# EAGLE design uctester (EAGLE 9.6.2)
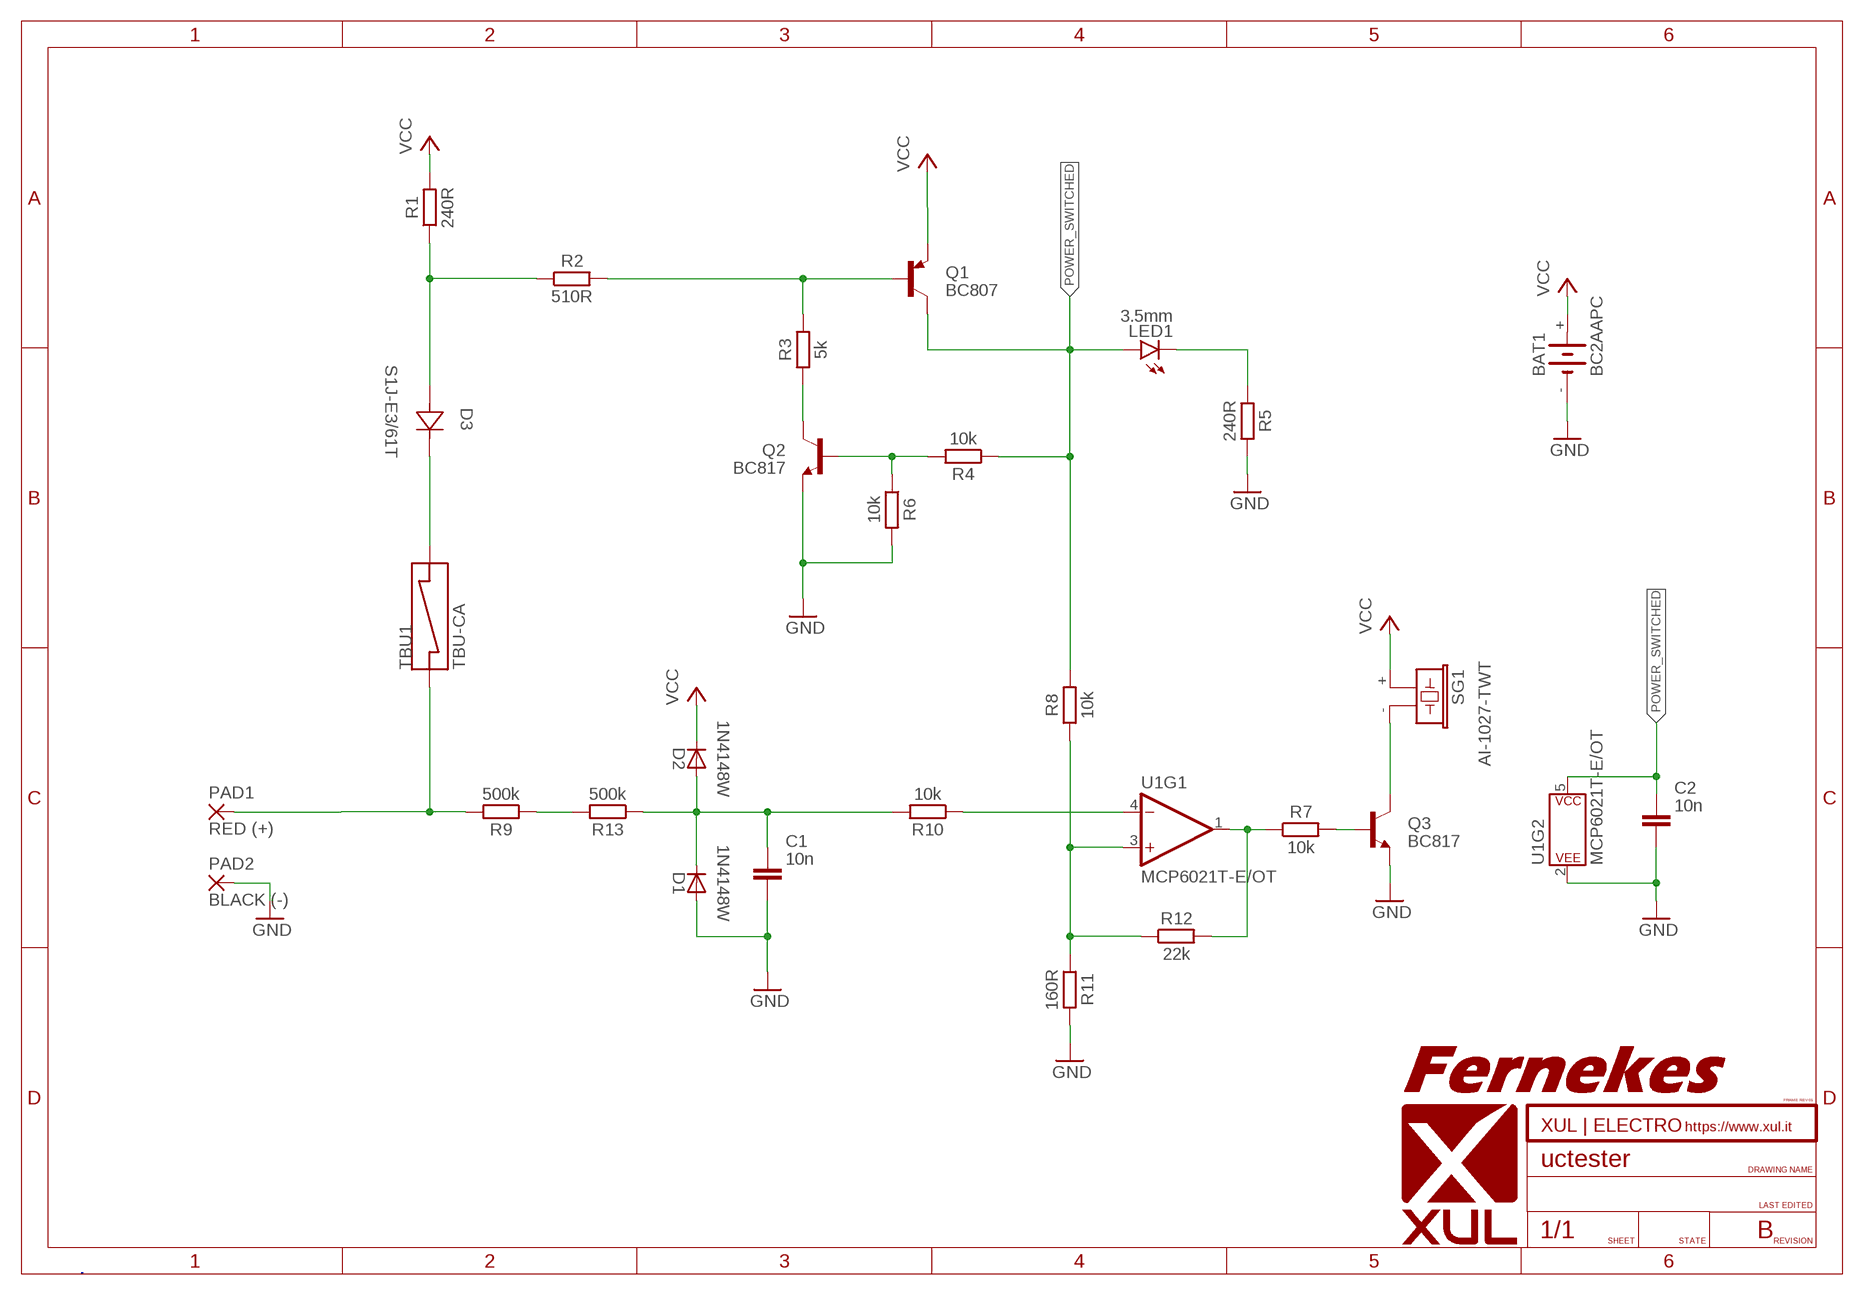
[diagram p0: schematic, sheet 1]
FRAME1 (FRAME-XUL-A4L-LOC): REV: B

## Parts
BAT1  BC2AAPC  [BC2AAPC]
C1  10n  C_CHIP-1206(3216-METRIC)  [CAPC3216X135]
C2  10n  C_CHIP-1206(3216-METRIC)  [CAPC3216X135]
D1  1N4148W  DIODESOD-123  [SOD-123]
D2  1N4148W  DIODESOD-123  [SOD-123]
D3  S1J-E3/61T  [DIODE_DO214AC]
LED1  3.5mm  LED5MM  [LED5MM]
PAD1  RED (+)  WIREPADSMD2,54-5,08  [SMD2,54-5,08]
PAD2  BLACK (-)  WIREPADSMD2,54-5,08  [SMD2,54-5,08]
Q1  BC807  BC807-40SMD  [SOT23-BEC]
Q2  BC817  BC817-40LT1SMD  [SOT23-BEC]
Q3  BC817  BC817-40LT1SMD  [SOT23-BEC]
R1  240R  R_CHIP-1206(3216-METRIC)  [RESC3216X70]
R2  510R  R_CHIP-1206(3216-METRIC)  [RESC3216X70]
R3  5k  R_CHIP-1206(3216-METRIC)  [RESC3216X70]
R4  10k  R_CHIP-1206(3216-METRIC)  [RESC3216X70]
R5  240R  R_CHIP-1206(3216-METRIC)  [RESC3216X70]
R6  10k  R_CHIP-1206(3216-METRIC)  [RESC3216X70]
R7  10k  R_CHIP-1206(3216-METRIC)  [RESC3216X70]
R8  10k  R_CHIP-1206(3216-METRIC)  [RESC3216X70]
R9  500k  R_CHIP-1206(3216-METRIC)  [RESC3216X70]
R10  10k  R_CHIP-1206(3216-METRIC)  [RESC3216X70]
R11  160R  R_CHIP-1206(3216-METRIC)  [RESC3216X70]
R12  22k  R_CHIP-1206(3216-METRIC)  [RESC3216X70]
R13  500k  R_CHIP-1206(3216-METRIC)  [RESC3216X70]
SG1  AI-1027-TWT  [AI-1027-TWT]
TBU1  TBU-CA  [RESDFN650X400X90-2N]
U1  MCP6021T-E/OT  [SOT95P280X145-5N]

## Nets
GND: BAT1.- C1.2 C2.2 D1.A PAD2.1(P) Q2.E Q3.E R5.2 R6.2 R11.2 U1.2(P$V-)
N$1: Q2.C R3.1
N$2: Q2.B R4.2 R6.1
N$3: R9.1 R13.2
N$4: R10.1 U1.4(-IN)
N$5: R8.1 R11.1 R12.1 U1.3(+IN)
N$6: R7.1 R12.2 U1.1(OUT)
N$7: Q3.B R7.2
N$8: Q3.C SG1.-
N$9: Q1.B R2.2 R3.2
N$11: C1.1 D1.C D2.A R10.2 R13.1
N$12: D3.2(A) R1.1 R2.1
N$13: PAD1.1(P) R9.2 TBU1.1
N$14: LED1.K(C) R5.1
N$15: D3.1(C) TBU1.3
POWER_SWITCHED: C2.1 LED1.A Q1.C R4.1 R8.2 U1.5(P$V+)
VCC: BAT1.+ D2.C Q1.E R1.2 SG1.+

## Notes on the sheet
- C:/Users/xi/Downloads/fernekes.bmp

## Library data of the parts
BAT1 = xul:BC2AAPC: BC2APPC 2x AA (series) battery holder, TH mount
C1 C2 = Capacitor:C: Capacitor - Generic; CATEGORY: Capacitor
D1 D2 = adafruit:DIODE: Diode SMADIODE - SMA Surface Mount Package 20V 1A Schottky Diode Digikey: 641-1014-6-ND DO-1N4148 - Through Hole Small Current Diode SOD-123 20V 1 A (.5mV Vf) Schottky Diode - Digikey: MBRX120TPMSCT-ND SOD-323 10V 570mA (.38mV Vf, 3ns) Schottky Diode - Digikey: ZLLS410CT-ND SOD-523 30V 30mA Schottky Diode (RB751S-40TE61) - Digikey: RB751S-40TE61CT-ND SOT23-R/W - SOT23 Package (R = Solder Paste/Reflow Ovens, W = Hand-Soldering) BAT54Film 40V 300mA - Digikey: 497-7162-1-ND
D3 = xul:S1J-E3/61T; BUILT_BY: EMA_UL_Team; MANUFACTURER_PART_NUMBER: S1J-E3/61T; VENDOR: Vishay
LED1 = led:LED: LED OSRAM: - CHIPLED LG R971, LG N971, LY N971, LG Q971, LY Q971, LO R971, LY R971 LH N974, LH R974 LS Q976, LO Q976, LY Q976 LO Q996 - Hyper CHIPLED LW Q18S LB Q993, LB Q99A, LB R99A - SideLED LS A670, LO A670, LY A670, LG A670, LP A670 LB A673, LV A673, LT A673, LW A673 LH A674 LY A675 LS A676, LA A676, LO A676, LY A676, LW A676 LS A679, LY A679, LG A679 - Hyper Micro SIDELED® LS Y876, LA Y876, LO Y876, LY Y876 LT Y87S - SmartLED LW L88C, LW L88S LB L89C, LB L89S, LG L890 LS L89K, LO L89K, LY L89K LS L896, LA L896, LO L896, LY L896 - TOPLED LS T670, LO T670, LY T670, LG T670, LP T670 LSG T670, LSP T670, LSY T670, LOP T670, LYG T670 LG T671, LOG T671, LSG T671 LB T673, LV T673, LT T673, LW T673 LH T674 LS T676, LA T676, LO T676, LY T676, LB T676, LH T676, LSB T676, LW T676 LB T67C, LV T67C, LT T67C, LS T67K, LO T67K, LY T67K, LW E67C LS E67B, LA E67B, LO E67B, LY E67B, LB E67C, LV E67C, LT E67C LW T67C LS T679, LY T679, LG T679 LS T770, LO T770, LY T770, LG T770, LP T770 LB T773, LV T773, LT T773, LW T773 LH T774 LS E675, LA E675, LY E675, LS T675 LS T776, LA T776, LO T776, LY T776, LB T776 LHGB T686 LT T68C, LB T68C - Hyper Mini TOPLED® LB M676 - Mini TOPLED Santana® LG M470 LS M47K, LO M47K, LY M47K Source: http://www.osram.convergy.de LUXEON: - LUMILED® LXK2-PW12-R00, LXK2-PW12-S00, LXK2-PW14-U00, LXK2-PW14-V00 LXK2-PM12-R00, LXK2-PM12-S00, LXK2-PM14-U00 LXK2-PE12-Q00, LXK2-PE12-R00, LXK2-PE12-S00, LXK2-PE14-T00, LXK2-PE14-U00 LXK2-PB12-K00, LXK2-PB12-L00, LXK2-PB12-M00, LXK2-PB14-N00, LXK2-PB14-P00, LXK2-PB14-Q00 LXK2-PR12-L00, LXK2-PR12-M00, LXK2-PR14-Q00, LXK2-PR14-R00 LXK2-PD12-Q00, LXK2-PD12-R00, LXK2-PD12-S00 LXK2-PH12-R00, LXK2-PH12-S00 LXK2-PL12-P00, LXK2-PL12-Q00, LXK2-PL12-R00 Source: www.luxeon.com KINGBRIGHT: KA-3528ASYC Source: www.kingbright.com
PAD1 PAD2 = wirepad:WIREPAD: Wire PAD connect wire on PCB
Q1 = transistor-pnp:BC807*: PNP Transistror
Q2 Q3 = transistor-npn:BC817*: NPN Transistor
R1-R13 = resistor:R: Resistor Fixed - Generic; CATEGORY: Resistor; SUB-CATEGORY: Fixed
SG1 = xul:AI-1027-TWT: BUZZER Source: Buerklin; OC_FARNELL: unknown; OC_NEWARK: unknown
TBU1 = xul:TBU-CA
U1 = xul:MCP6021: MCP6021T-E/OT OP AMP Rail-to-rail input/output op-amp with 10 MHz bandwidth. SparkFun Products ZX Distance and Gesture Sensor <https://www.sparkfun.com/products/12780> (SEN-12780)

## Board
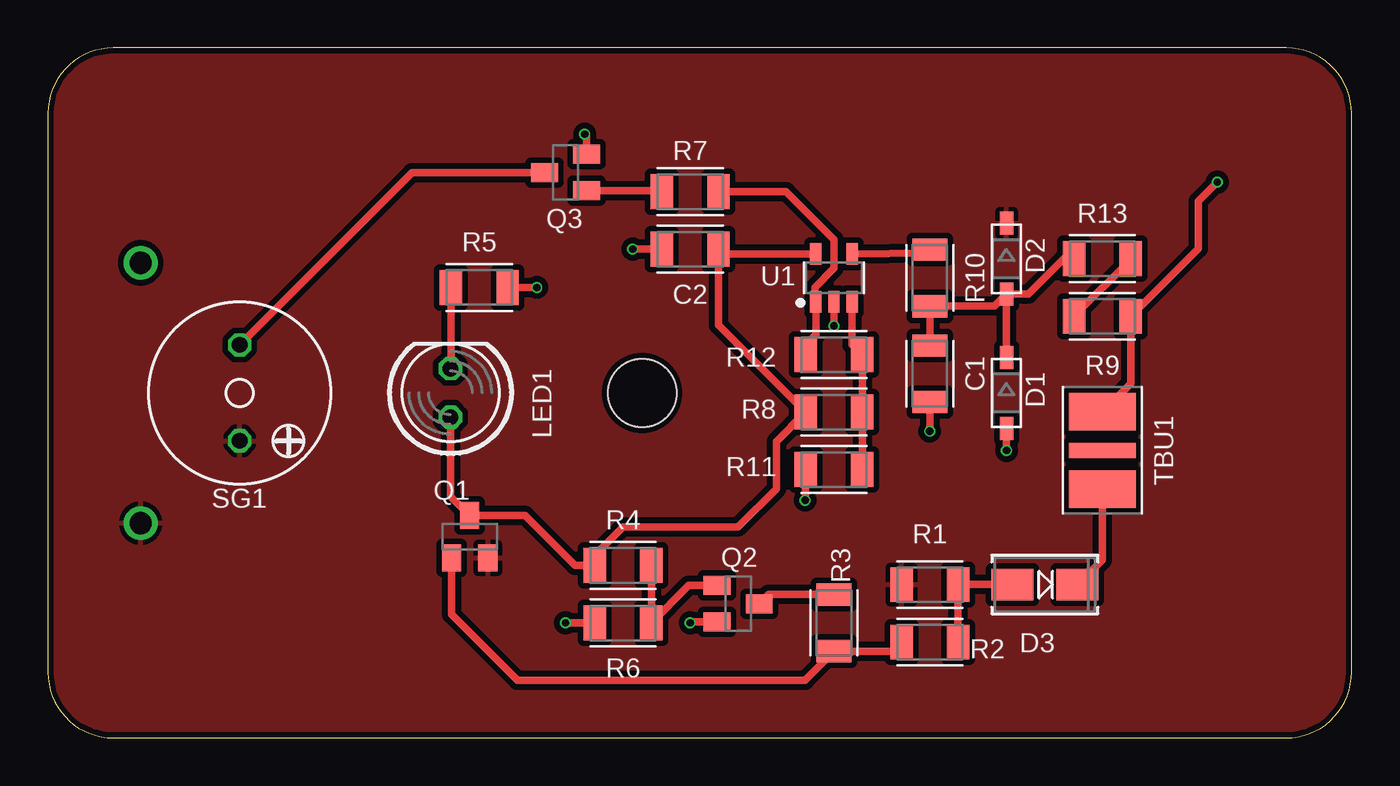
[diagram p1: board, top side]
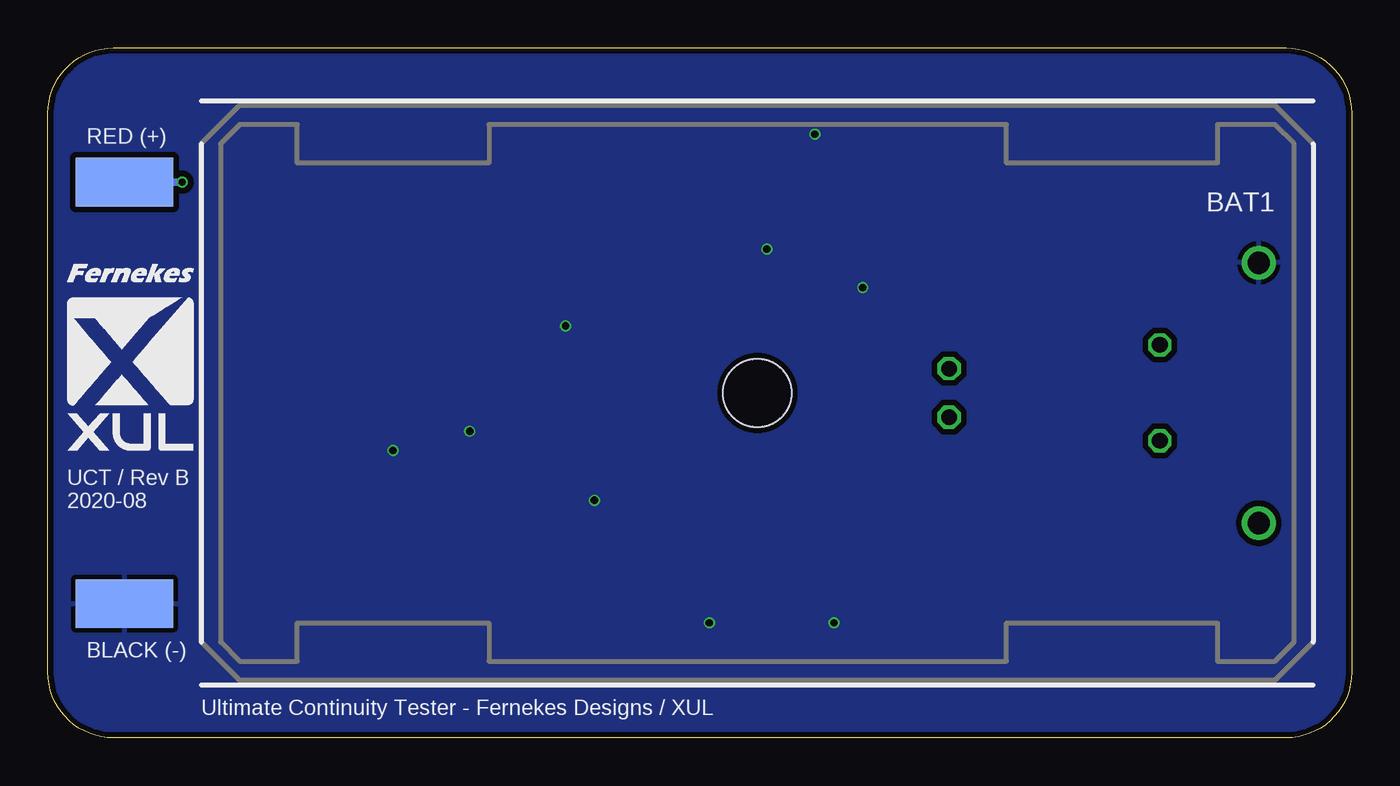
[diagram p2: board, bottom side, seen from below]

Size 68 x 36 mm. Coordinates in mm from the lower left corner, seen from the top.
Outline: 3.41,0 64.59,0 arc90 68,3.41 68,32.59 arc90 64.59,36 3.41,36 arc90 0,32.59 0,3.41 arc90 3.41,0
Copper layers (1*16): Top 0.035559375mm / dielectric 1.6mm / Bottom 0.035559375mm
Design rules "jlcpcb2layer-ext": minimum track width 5mil, minimum drill 12mil, track to track 5mil, track to pad 5mil, pad to pad 5mil, via to via 5mil, smd to smd 5mil, copper to edge 8mil, drill to drill 6mil, minimum pad ring 5mil, minimum via ring 3mil, stop-mask expansion 2.5mil, vias tented up to drill 0mil, thermal gap 10mil

### Footprints (pad centres in the part's own frame; a part is rotated, then mirrored left to right if it is on the bottom)
BC2AAPC = drill 1.17: + 26.16,-6.795; - 26.16,6.795 | hole 3.56: 0,0
CAPC3216X135 = smd 1.165 x 1.815: 1 -1.475,0; 2 1.475,0
SOD-123 = smd 1.2 x 0.7: A 1.85,0; C -1.85,0
DIODE_DO214AC = smd 2.184 x 1.651: 1 -1.702,0; 2 1.702,0
LED5MM = drill 0.813 octagon: A -1.27,0; K 1.27,0
SMD2,54-5,08 = smd 2.54 x 5.08: 1 0,0
SOT23-BEC = smd 1 x 1.4: B -0.95,-1.1; C 0,1.1; E 0.95,-1.1
RESC3216X70 = smd 1.165 x 1.815: 1 -1.475,0; 2 1.475,0
AI-1027-TWT = drill 0.813 octagon: + 2.5,0; - -2.5,0
RESDFN650X400X90-2N = smd 1.962 x 3.512: 1 -2.025,0; 3 2.025,0 | smd 0.8 x 3.512: 2 0,0
SOT95P280X145-5N = smd 1.119 x 0.59: 1 -1.246,0.95; 2 -1.246,0; 3 -1.246,-0.95; 4 1.246,-0.95; 5 1.246,0.95

### Placement (x,y rotation side)
BAT1  31,18 0 bottom
C1  46,19 270 top
C2  33.5,25.5 180 top
D1  50,18 270 top
D2  50,25 270 top
D3  52,8 180 top
LED1  21,18 90 top
PAD1  64,29 90 bottom
PAD2  64,7 90 bottom
Q1  22,10.5 0 top
Q2  36,7 270 top
Q3  27,29.5 90 top
R1  46,8 180 top
R2  46,5 180 top
R3  41,6 270 top
R4  30,9 0 top
R5  22.5,23.5 0 top
R6  30,6 180 top
R7  33.5,28.5 180 top
R8  41,17 180 top
R9  55,22 0 top
R10  46,24 270 top
R11  41,14 180 top
R12  41,20 180 top
R13  55,25 0 top
SG1  10,18 270 top
TBU1  55,15 270 top
U1  41,24 90 top
U$1  [XUL-LOGO-8MMH]  67,23 0 bottom

### Tracks (layer width: path | path; a pad name or v marks a point on that pad's centre or on a via)
GND  (via drill 0.38)
  Top 0.4: R5.2 v25.5,23.5 | Q3.E 28.1,31.4 v28,31.5 | R6.2 v27,6 | C2.2 v30.5,25.5 | C1.2 v46,16 | D1.A v50,15 | Q2.E 33.55,6.05 v33.5,6 | R11.2 39.52,12.43 v39.5,12.4 | U1.2 v41,21.5
  pour Bottom (isolate 0.305): 0,36 0,0 68,0 68,36
N$1
  Top 0.4: Q2.C 37.58,7.47 R3.1
N$2
  Top 0.4: R4.2 R6.1 33.42,7.95 Q2.B
N$3
  Top 0.4: R9.1 56.48,24.95 R13.2
N$4
  Top 0.4: U1.4 45.83,25.3 R10.1
N$5
  Top 0.4: R11.1 R8.1 R12.1 41.95,20.52 U1.3
N$6
  Top 0.4: R12.2 39.52,20.52 40.05,21.05 U1.1 40,22.8 40,23.5 41,24.5 41,26 38.5,28.5 R7.1
N$7
  Top 0.4: Q3.B 31.98,28.55 R7.2
N$8
  Top 0.4: Q3.C 19,29.5 SG1.-
N$9
  Top 0.4: R2.2 44.05,4.53 R3.2 39.48,3 24.5,3 21.05,6.45 Q1.B
N$11
  Top 0.4: C1.1 R10.2 49.38,22.52 D2.A | D2.A D1.C | D2.A 51.15,23.15 53,25 R13.1
N$12
  Top 0.4: D3.2 R1.1 R2.1
N$13  (via drill 0.38)
  Top 0.4: TBU1.1 56.48,18.5 R9.2 60,25.52 60,28 v61,29
  Bottom 0.4: v61,29 PAD1.1
N$14
  Top 0.4: LED1.K 21.02,19.3 R5.1
N$15
  Top 0.4: TBU1.3 55,9.3 D3.1
POWER_SWITCHED
  Top 0.4: U1.5 35.23,25.25 C2.1 34.98,21.55 R8.2 38,15.47 38,13 36,11 30,11 28.52,9.53 R4.1 27.5,9 24.9,11.6 Q1.C 21,12.6 LED1.A
VCC
  pour Top (isolate 0.305): 0,36 0,0 68,0 68,36

### Text on the board
bPlace: UCT / Rev B / 2020-08 | Ultimate Continuity Tester - Fernekes Designs / XUL
bNames: RED (+) | BLACK (-)